# Altium schematic sheet OZ440-SE130-CAR001-SCH3.SchDoc: Carte IHM: alimentation
size A3; Date: 08/07/14; CheckedBy: GS; Author: BM; DocumentNumber: OZ440-SE130-CAR001-SCH03; Revision: 1; SheetNumber: 1; SheetTotal: 1
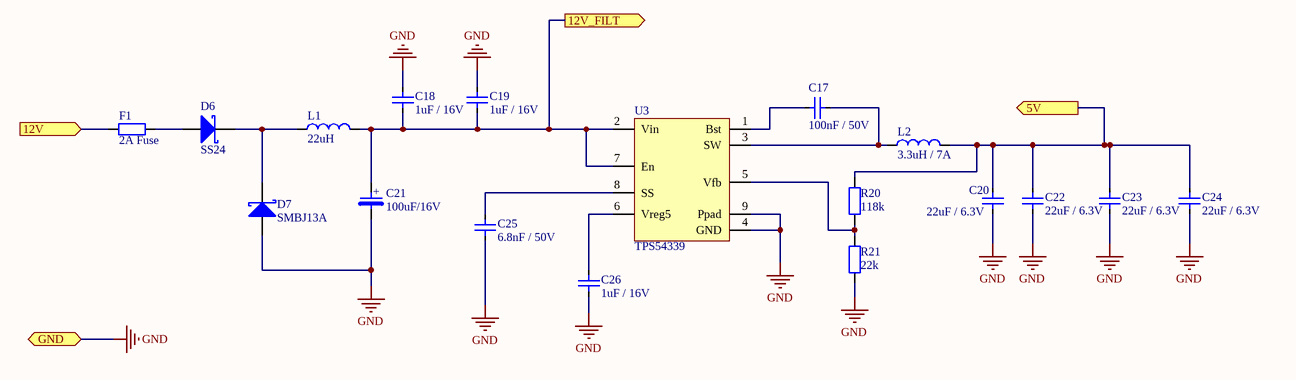
[diagram p0: OZ440-SE130-CAR001-SCH3.SchDoc]

## Parts
C17  Displayed reference: 100nF / 50V  [C0805-STD]  (hidden comment: CAP-SMD)
C18  Displayed reference: 1uF / 16V  [C0805-STD]  (hidden comment: CAP-SMD)
C19  Displayed reference: 1uF / 16V  [C0805-STD]  (hidden comment: CAP-SMD)
C20  Displayed reference: 22uF / 6.3V  [C0805-STD]  (hidden comment: CAP-SMD)
C21  Displayed reference: 100uF/16V  [CAP-ELECTRO-SMD]  (hidden comment: CAP-POL-SMD)
C22  Displayed reference: 22uF / 6.3V  [C0805-STD]  (hidden comment: CAP-SMD)
C23  Displayed reference: 22uF / 6.3V  [C0805-STD]  (hidden comment: CAP-SMD)
C24  Displayed reference: 22uF / 6.3V  [C0805-STD]  (hidden comment: CAP-SMD)
C25  Displayed reference: 6.8nF / 50V  [C0805-STD]  (hidden comment: CAP-SMD)
C26  Displayed reference: 1uF / 16V  [C0805-STD]  (hidden comment: CAP-SMD)
D6  Displayed reference: SS24  [DO214AA-STD]  (hidden comment: DIODE_SCHOTKY-DO214AA)
D7  Displayed reference: SMBJ13A  [DO214AA-STD]  (hidden comment: DIODE_SCHOTKY-DO214AA)
F1  Displayed reference: 2A Fuse  [R0805-STD]  (hidden comment: RES-SMD)
L1  Displayed reference: 22uH  [L-SPE-LPS6235]  (hidden comment: IND-SMD)
L2  Displayed reference: 3.3uH / 7A  [L-SPE-EPL6024]  (hidden comment: IND-SMD)
R20  Displayed reference: 118k  [R0805-STD]  (hidden comment: RES-SMD)
R21  Displayed reference: 22k  [R0805-STD]  (hidden comment: RES-SMD)
U3  Displayed reference: TPS54339  [SO8_THERMAL-STD]  (hidden comment: TPS54339-SO8)

## Ports
5V (out), 12V (in), 12V_FILT (out), GND

## Nets
GND: C18.2 C19.2 C20.1 C21.2 C22.1 C23.1 C24.1 C25.1 C26.1 D7.A R21.1 U3.4(GND) U3.9(Ppad) ; port GND
5V: C20.2 C22.2 C23.2 C24.2 L2.2 R20.2 ; port 5V
12V: F1.1 ; port 12V
12V_FILT: C18.1 C19.1 C21.1 L1.2 U3.2(Vin) U3.7(En) ; port 12V_FILT
NetC17_1: C17.1 U3.1(Bst)
NetC17_2: C17.2 L2.1 U3.3(SW)
NetC25_2: C25.2 U3.8(SS)
NetC26_2: C26.2 U3.6(Vreg5)
NetD6_A: D6.A F1.2
NetD6_K: D6.K D7.K L1.1
NetR20_1: R20.1 R21.2 U3.5(Vfb)

## Notes on the sheet
- Titre document:
- NAIO TECHNOLOGIES
- 3 Av didier Daurat
- 31400 TOULOUSE
- Auteur:
- Numéro document:
- Verificateur:
- Format:
- A3
- Date:
- Revision:
- Page:
- /
- (in symbol B41142A4107M) +

## Library data of the parts
C17 = VJ0805Y104KXAxx: 0805 100nF / 50V  X7R ceramic capacitor; Manufacturer: vishay; Max Voltage: 50; Tolerance: +/- 10%; Validated: N; Reference: VJ0805Y104KXAxx; Value: 100nF; Material: X7R; Footprint description: standard Capacitor 0805; Pin Count: 2; helpURL: http://www.vishay.com/docs/45200/highrels.pdf; Supplier 1: Farnell; Supplier Part Number 1: 1612208; Supplier 2: Digi-Key; Supplier Part Number 2: 720-1266-6-ND
C18 C19 C26 = C0805C105K4RACxx: 0805 1uF / 16V X7R ceramic capacitor; Manufacturer: Kemet; Max Voltage: 16; Tolerance: +/- 10%; Validated: N; Reference: C0805C105K4RACxx; Value: 1uF; Material: X7R; Footprint description: standard Capacitor 0805; Pin Count: 2; helpURL: http://www.farnell.com/datasheets/40863.pdf; Supplier 1: Farnell; Supplier Part Number 1: 9227792; Supplier 2: Digi-Key; Supplier Part Number 2: 399-6930-1-ND
C20 C22-C24 = C0805C226M9PACxx: 0805 22uF / 6.3V X5R ceramic capacitor; Manufacturer: Kemet; Max Voltage: 6.3; Tolerance: +/- 20%; Validated: N; Reference: C0805C226M9PACxx; Value: 22uF; Material: X5R; Footprint description: standard Capacitor 0805; Pin Count: 2; helpURL: http://www.farnell.com/datasheets/40863.pdf; Supplier 1: Farnell; Supplier Part Number 1: 1108326; Supplier 2: Digi-Key; Supplier Part Number 2: 399-4696-1-ND
C21 = B41142A4107M: 100uF/16V Aluminium capacitor SMD; Manufacturer: Epcos; Value: 100uF; Max Voltage: 16V; Reference: B41142A4107M; Material: Aluminium; Footprint description: 6.3mm x 7.7mm; Pin Count: 2; helpURL: www.epcos.com/inf/20/30/db/alu_x/B41142.pdf; Supplier 1: Farnell; Supplier Part Number 1: 1735328; Supplier 2: Mouser; Supplier Part Number 2: 871-B41142A4107M
C25 = C0805C682J5GACxx: 0805 6.8nF / 50V COG ceramic capacitor; Manufacturer: Kemet; Max Voltage: 50; Tolerance: +/- 5%; Validated: N; Reference: C0805C682J5GACxx; Value: 6.8nF; Material: COG; Footprint description: standard Capacitor 0805; Pin Count: 2; helpURL: http://www.farnell.com/datasheets/40863.pdf; Supplier 1: Mouser; Supplier Part Number 1: 80-C0805C682J5G; Supplier 2: Farnell; Supplier Part Number 2: 1535571
D6 = SS24-E3/xxx: 2A/40V schottky diode in SMB package; Manufacturer: VISHAY; Max Voltage: 40V; Max Current: 2A; Validated: False; Reference: SS24-E3/xxx; component type: DIODE; Footprint description: DO-214AA SMD footprint; Pin Count: 2; Rev: 03/2012; helpURL: http://www.vishay.com/docs/88748/88748.pdf; Supplier 1: Mouser; Supplier Part Number 1: 625-SS24-E3; Supplier 2: Farnell; Supplier Part Number 2: 1843487
D7 = SMBJ13A: 13V TVS diode, 600W; Manufacturer: LITTLEFUSE; Validated: False; Reference: SMBJ13A; component type: DIODE; Max Voltage: 13V; Rated Power: 600W; Footprint description: DO214AA; Pin Count: 2; helpURL: http://www.mouser.com/ds/2/240/Littelfuse_TVS-Diode_SMBJ-48653.pdf; Supplier 1: Farnell; Supplier Part Number 1: 3130150; Supplier 2: Mouser; Supplier Part Number 2: 576-SMBJ13A
F1 = F0805B2R00FWTR: 0805 2A 63V fuse; Manufacturer: AVX; Validated: False; Reference: F0805B2R00FWTR; Max Current: 2A; Pin Count: 2; helpURL: http://www.mouser.com/ds/2/40/accug2-25369.pdf; Supplier 1: Mouser; Supplier Part Number 1: 581-F0805B2R00FWTR; Supplier 2: Digi-Key; Supplier Part Number 2: F0805B2R00FWTR-ND
L1 = LPS6235-223MR: 22uH SMD inductor; Manufacturer: Coilcraft; Max Current: 1.6A; Validated: False; Reference: LPS6235-223MR; Value: 22uH; Footprint description: SMD 2 pin low profile; Pin Count: 2; Rev: 08/01/13; helpURL: http://www.coilcraft.com/pdfs/lps6235.pdf; Supplier 1: Mouser; Supplier Part Number 1: 994-LPS6235-223MRB; Supplier 2: Farnell; Supplier Part Number 2: 2408291
L2 = EPL6024-332MEB: 3.3uH 7A SMD inductor; Manufacturer: COILCRAFT; Validated: False; Reference: EPL6024-332MEB; Value: 3.3uH; Max Current: 7A; Footprint description: SMD 2 pin; Pin Count: 2; Rev: 5/10/12; helpURL: http://www.coilcraft.com/pdfs/epl6024.pdf; Supplier 1: Mouser; Supplier Part Number 1: 994-EPL6024-332MEB; Supplier 2: Farnell; Supplier Part Number 2: 2287424
R20 = CRCW0805118KFKxx: 118k Ohm 0805 SMD resistor; Manufacturer: Vishay; Value: 118 000; Tolerance: 1%; Rated Power: 0.125W; Validated: No; Reference: CRCW0805118KFKxx; Footprint description: standard 0805 SMD; Pin Count: 2; helpURL: http://www.vishay.com/docs/20035/dcrcwe3.pdf; Supplier 1: Mouser; Supplier Part Number 1: 71-CRCW0805-118K-E3; Supplier 2: Farnell; Supplier Part Number 2: 2316485
R21 = CRCW080522K0FKxx: 22k Ohm 0805 SMD resistor; Manufacturer: Vishay; Value: 22 000; Tolerance: 1 %; Rated Power: 0,125 W; Validated: No; Reference: CRCW080522K0FKxx; Footprint description: standard 0805 SMD; Pin Count: 2; helpURL: http://www.vishay.com/docs/20035/dcrcwe3.pdf; Supplier 1: Farnell; Supplier Part Number 1: 1469896; Supplier 2: Mouser; Supplier Part Number 2: 71-CRCW0805-22K-E3
U3 = TPS54339DDA: 4.5 V to 23 V Input, 3-A Step-Down DCDC; Manufacturer: TI; Max Voltage: 23V; Max Current: 3A; Validated: False; Reference: TPS54339DDA; Footprint description: SO8 with thermal PAD; Pin Count: 8; Rev: 01/13; helpURL: http://www.ti.com/lit/ds/symlink/tps54339.pdf; Supplier 1: Mouser; Supplier Part Number 1: 595-TPS54339DDA; Supplier 2: Farnell; Supplier Part Number 2: 2307962